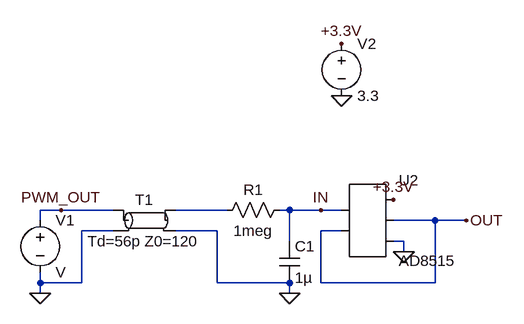
[diagram p0: schematic PWMtoDC.asc]
PWMtoDC.asc, the LTspice schematic file:
Version 4
SHEET 1 880 680
WIRE 64 160 32 160
WIRE 144 160 64 160
WIRE 320 160 240 160
WIRE 416 160 400 160
WIRE 464 160 416 160
WIRE 496 160 464 160
WIRE 32 176 32 160
WIRE 640 176 576 176
WIRE 688 176 640 176
WIRE 144 192 96 192
WIRE 304 192 240 192
WIRE 496 192 464 192
WIRE 416 208 416 160
WIRE 592 208 576 208
WIRE 592 224 592 208
WIRE 32 272 32 256
WIRE 96 272 96 192
WIRE 96 272 32 272
WIRE 304 272 304 192
WIRE 416 272 304 272
WIRE 464 272 464 192
WIRE 640 272 640 176
WIRE 640 272 464 272
WIRE 32 288 32 272
WIRE 416 288 416 272
FLAG 592 224 0
FLAG 496 -16 0
FLAG 496 -96 +3.3V
FLAG 576 144 +3.3V
FLAG 416 288 0
FLAG 32 288 0
FLAG 688 176 OUT
FLAG 464 160 IN
FLAG 64 160 PWM_OUT
SYMBOL tline 192 176 R0
SYMATTR InstName T1
SYMATTR Value Td=56p Z0=120
SYMBOL AutoGenerated\\AD8515 528 176 R0
SYMATTR InstName U2
SYMBOL voltage 32 160 R0
SYMATTR InstName V1
SYMBOL res 416 144 R90
WINDOW 0 0 56 VBottom 2
WINDOW 3 32 56 VTop 2
SYMATTR InstName R1
SYMATTR Value 1meg
SYMBOL cap 400 208 R0
SYMATTR InstName C1
SYMATTR Value 1µ
SYMBOL voltage 496 -112 R0
WINDOW 123 0 0 Left 2
WINDOW 39 0 0 Left 2
SYMATTR InstName V2
SYMATTR Value 3.3

The netlist it stands for:
* PWMtoDC.asc
T1 PWM_OUT 0 N001 0 Td=56p Z0=120
* U2: AD8515 (symbol AutoGenerated\AD8515 not available, pins judged from their places): pin1=IN pin2=OUT pin3=+3.3V pin4=OUT pin5=0
V1 PWM_OUT 0 V
R1 IN N001 1meg
C1 IN 0 1µ
V2 +3.3V 0 3.3
.backanno
.end